# EAGLE design 4x4 Keypad with ATMega32 (EAGLE 9.6.0)
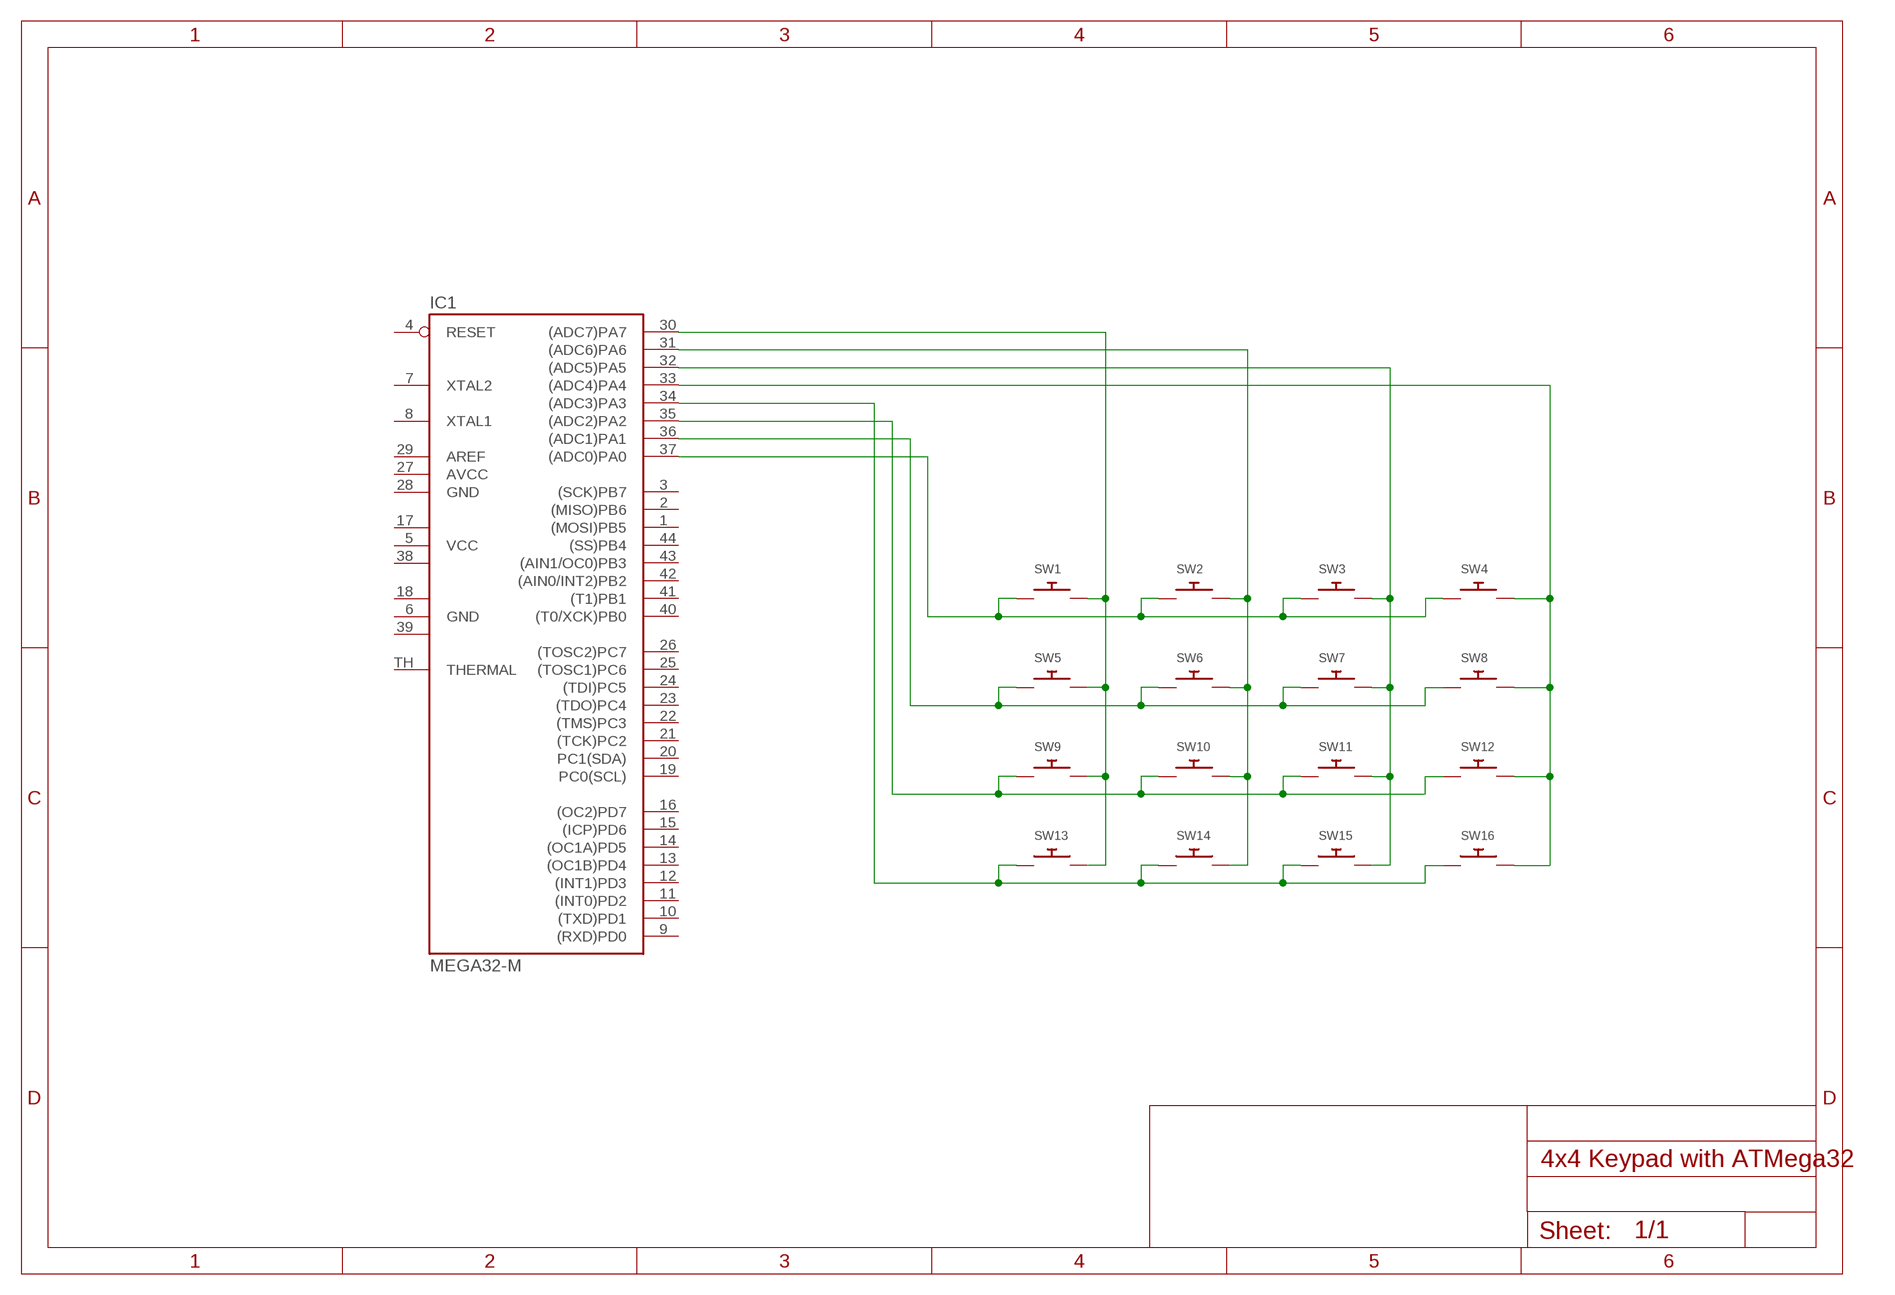
[diagram p0: schematic, sheet 1]

## Parts
IC1  MEGA32-M  [MLF44-TH]
SW1  SWITCH_PUSHBUTTONC&K_KSS  [BTN_CK_KSS]
SW2  SWITCH_PUSHBUTTONC&K_KSS  [BTN_CK_KSS]
SW3  SWITCH_PUSHBUTTONC&K_KSS  [BTN_CK_KSS]
SW4  SWITCH_PUSHBUTTONC&K_KSS  [BTN_CK_KSS]
SW5  SWITCH_PUSHBUTTONC&K_KSS  [BTN_CK_KSS]
SW6  SWITCH_PUSHBUTTONC&K_KSS  [BTN_CK_KSS]
SW7  SWITCH_PUSHBUTTONC&K_KSS  [BTN_CK_KSS]
SW8  SWITCH_PUSHBUTTONC&K_KSS  [BTN_CK_KSS]
SW9  SWITCH_PUSHBUTTONC&K_KSS  [BTN_CK_KSS]
SW10  SWITCH_PUSHBUTTONC&K_KSS  [BTN_CK_KSS]
SW11  SWITCH_PUSHBUTTONC&K_KSS  [BTN_CK_KSS]
SW12  SWITCH_PUSHBUTTONC&K_KSS  [BTN_CK_KSS]
SW13  SWITCH_PUSHBUTTONC&K_KSS  [BTN_CK_KSS]
SW14  SWITCH_PUSHBUTTONC&K_KSS  [BTN_CK_KSS]
SW15  SWITCH_PUSHBUTTONC&K_KSS  [BTN_CK_KSS]
SW16  SWITCH_PUSHBUTTONC&K_KSS  [BTN_CK_KSS]

## Nets
N$1: IC1.37((ADC0)PA0) SW1.P$1 SW2.P$1 SW3.P$1 SW4.P$1
N$2: IC1.33((ADC4)PA4) SW4.P$2 SW8.P$2 SW12.P$2 SW16.P$2
N$4: IC1.32((ADC5)PA5) SW3.P$2 SW7.P$2 SW11.P$2 SW15.P$2
N$5: IC1.35((ADC2)PA2) SW9.P$1 SW10.P$1 SW11.P$1 SW12.P$1
N$6: IC1.34((ADC3)PA3) SW13.P$1 SW14.P$1 SW15.P$1 SW16.P$1
N$7: IC1.31((ADC6)PA6) SW2.P$2 SW6.P$2 SW10.P$2 SW14.P$2
N$8: IC1.30((ADC7)PA7) SW1.P$2 SW5.P$2 SW9.P$2 SW13.P$2
N$9: IC1.36((ADC1)PA1) SW5.P$1 SW6.P$1 SW7.P$1 SW8.P$1
Unconnected: IC1.1((MOSI)PB5) IC1.2((MISO)PB6) IC1.3((SCK)PB7) IC1.4(RESET) IC1.7(XTAL2) IC1.8(XTAL1) IC1.9((RXD)PD0) IC1.10((TXD)PD1) IC1.11((INT0)PD2) IC1.12((INT1)PD3) IC1.13((OC1B)PD4) IC1.14((OC1A)PD5) IC1.15((ICP)PD6) IC1.16((OC2)PD7) IC1.19(PC0(SCL)) IC1.20(PC1(SDA)) IC1.21((TCK)PC2) IC1.22((TMS)PC3) IC1.23((TDO)PC4) IC1.24((TDI)PC5) IC1.25((TOSC1)PC6) IC1.26((TOSC2)PC7) IC1.29(AREF) IC1.40((T0/XCK)PB0) IC1.41((T1)PB1) IC1.42((AIN0/INT2)PB2) IC1.43((AIN1/OC0)PB3) IC1.44((SS)PB4) IC1.TH(THERMAL)

## Power pins joined to a net without a drawn wire
AVCC: IC1.27(AVCC)
GND: IC1.6(GND) IC1.28(GND)
GND1: IC1.18(GND1)
GND2: IC1.39(GND2)
VCC: IC1.5(VCC)
VCC1: IC1.17(VCC1)
VCC2: IC1.38(VCC2)

## Library data of the parts
IC1 = atmel:MEGA32-M: MICROCONTROLLER 32 Kbytes FLASH 2 Kbytes SRAM 1 Kbytes EEPROM USART 8-channel 10 bit ADC Source: www.atmel.com .. doc2503.pdf; MPN: ATMEGA32-16MU; OC_FARNELL: 1455108; OC_NEWARK: 58M3733
SW1-SW16 = adafruit:SWITCH_PUSHBUTTON: Buttons SOFTTOUCHSMD_SJ - Soft touch temporary push button (Super Junk Akihabara) Compatible with SKPMANE010 [Mouser: 688-SKPMAN] C&K_KSS = Digikey: KSS221GLFS

## Board
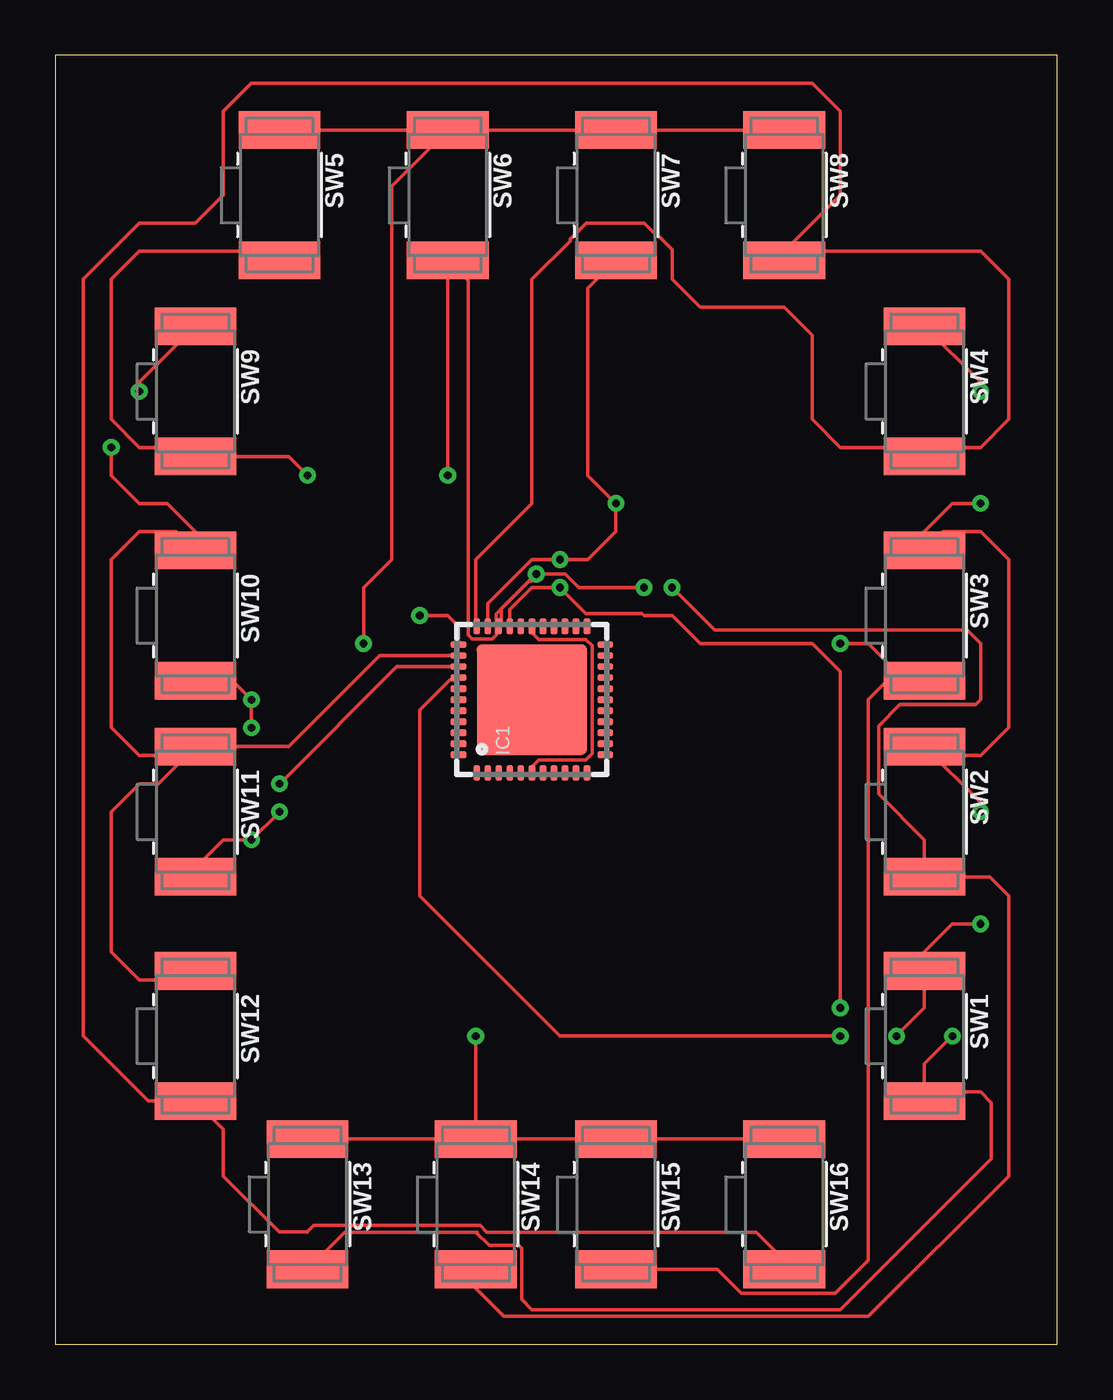
[diagram p1: board, top side]
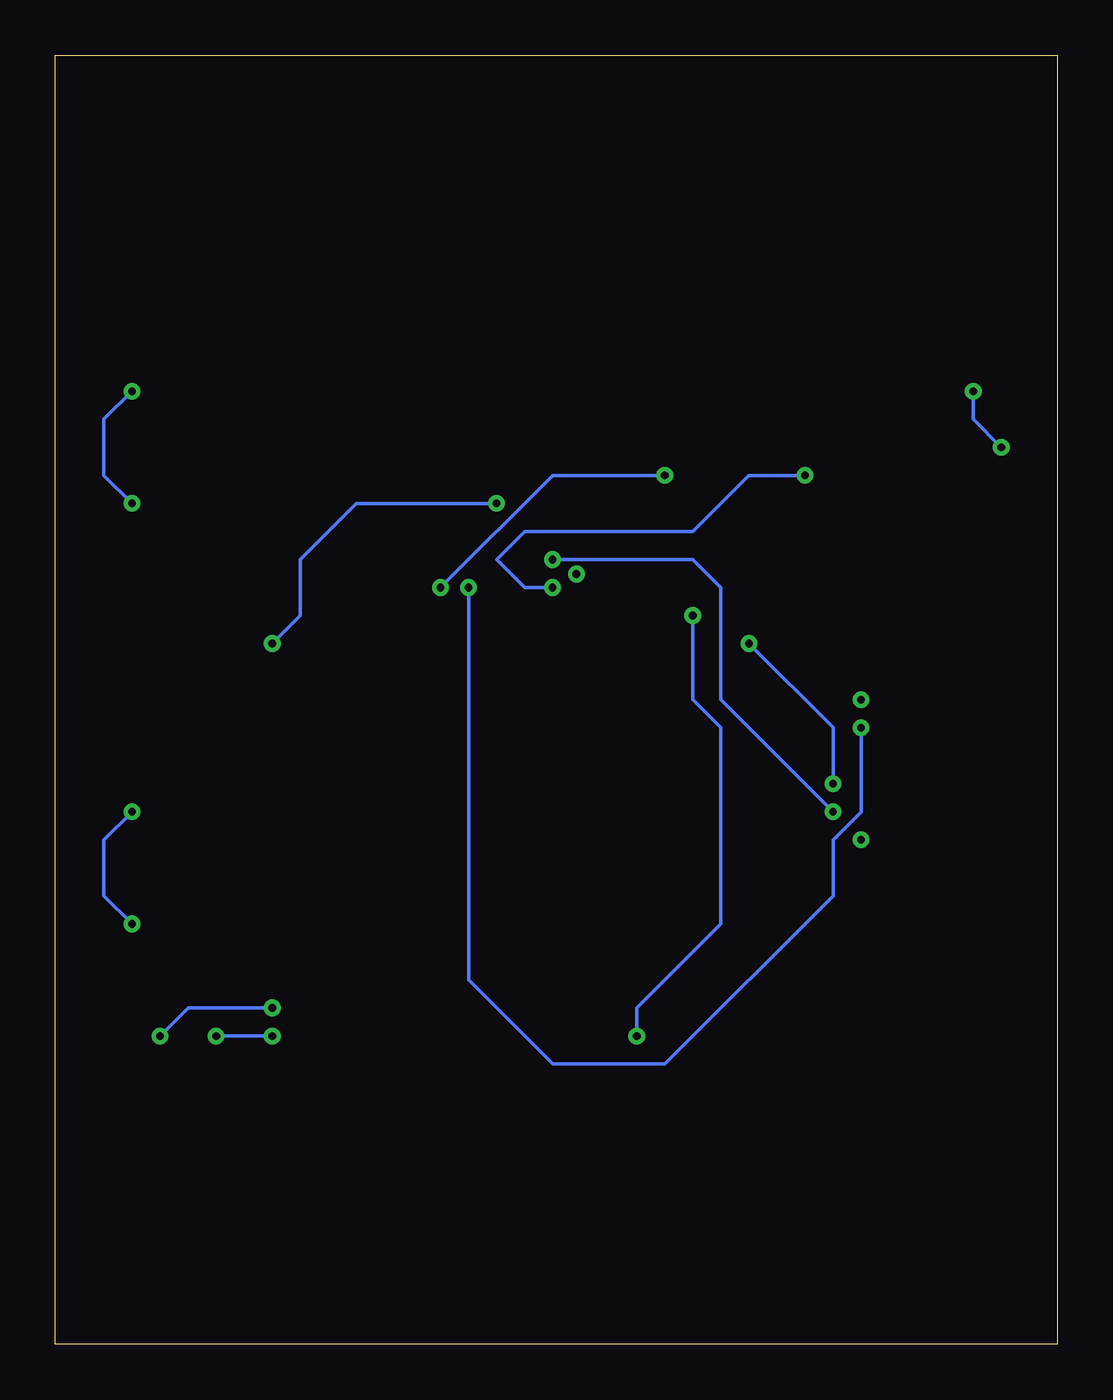
[diagram p2: board, bottom side, seen from below]

Size 45.39 x 58.41 mm. Coordinates in mm from the lower left corner, seen from the top.
Outline: 0,0 45.39,0 45.39,58.41 0,58.41 0,0
Copper layers (1*16): Top 0.035mm / dielectric 1.5mm / Bottom 0.035mm
Design rules "default": minimum track width 6mil, minimum drill 0.35mm, track to track 6mil, track to pad 6mil, pad to pad 6mil, via to via 6mil, smd to smd 6mil, copper to edge 40mil, drill to drill 6mil, minimum pad ring 10mil, minimum via ring 8mil, stop-mask expansion 4mil, vias tented up to drill 0mil, thermal gap 10mil

### Footprints (pad centres in the part's own frame; a part is rotated, then mirrored left to right if it is on the bottom)
MLF44-TH = smd 0.7 x 0.3: 1 -3.325,2.5; 2 -3.325,2; 3 -3.325,1.5; 4 -3.325,1; 5 -3.325,0.5; 6 -3.325,0; 7 -3.325,-0.5; 8 -3.325,-1; 9 -3.325,-1.5; 10 -3.325,-2; 11 -3.325,-2.5; 23 3.325,-2.5; 24 3.325,-2; 25 3.325,-1.5; 26 3.325,-1; 27 3.325,-0.5; 28 3.325,0; 29 3.325,0.5; 30 3.325,1; 31 3.325,1.5; 32 3.325,2; 33 3.325,2.5 | smd 0.3 x 0.7: 12 -2.5,-3.325; 13 -2,-3.325; 14 -1.5,-3.325; 15 -1,-3.325; 16 -0.5,-3.325; 17 0,-3.325; 18 0.5,-3.325; 19 1,-3.325; 20 1.5,-3.325; 21 2,-3.325; 22 2.5,-3.325; 34 2.5,3.325; 35 2,3.325; 36 1.5,3.325; 37 1,3.325; 38 0.5,3.325; 39 0,3.325; 40 -0.5,3.325; 41 -1,3.325; 42 -1.5,3.325; 43 -2,3.325; 44 -2.5,3.325 | smd 5 x 5: TH 0,0
BTN_CK_KSS = smd 1.7 x 3.7: P$1 -2.95,0; P$2 2.95,0

### Placement (x,y rotation side)
IC1  21.59,29.21 90 top
SW1  39.37,13.97 270 top
SW2  39.37,24.13 270 top
SW3  39.37,33.02 270 top
SW4  39.37,43.18 270 top
SW5  10.16,52.07 270 top
SW6  17.78,52.07 270 top
SW7  25.4,52.07 270 top
SW8  33.02,52.07 270 top
SW9  6.35,43.18 270 top
SW10  6.35,33.02 270 top
SW11  6.35,24.13 270 top
SW12  6.35,13.97 270 top
SW13  11.43,6.35 270 top
SW14  19.05,6.35 270 top
SW15  25.4,6.35 270 top
SW16  33.02,6.35 270 top

### Tracks (layer width: path | path; a pad name or v marks a point on that pad's centre or on a via)
GND
  Top 0.152: IC1.28 21.59,32.26 21.91,31.94 24.04,31.94 24.32,31.66 24.32,26.76 24.04,26.48 21.91,26.48 21.59,26.16 IC1.6
N$1  (via drill 0.35)
  Top 0.152: SW4.P$1 41.91,43.59 v41.91,43.18 | v41.91,24.13 41.91,24.54 SW2.P$1 39.78,26.67 41.91,26.67 43.18,27.94 43.18,35.56 41.91,36.83 40.23,36.83 SW3.P$1 39.37,36.83 40.64,38.1 v41.91,38.1 | v41.91,19.05 40.64,19.05 39.37,17.78 SW1.P$1 39.37,15.24 v38.1,13.97 | IC1.37 18.14,30.09 17.86,30.09 16.51,28.73 16.51,20.32 22.86,13.97 v35.56,13.97
  Bottom 0.152: v41.91,24.13 43.18,22.86 43.18,20.32 v41.91,19.05 | v41.91,43.18 43.18,41.91 43.18,39.37 v41.91,38.1 | v35.56,13.97 v38.1,13.97
N$2
  Top 0.152: SW8.P$2 33.23,49.33 | 33.23,49.33 33.43,49.53 41.91,49.53 43.18,48.26 43.18,41.91 41.91,40.64 39.37,40.64 SW4.P$2 38.96,40.64 35.56,40.64 34.29,41.91 34.29,45.72 33.02,46.99 29.21,46.99 27.94,48.26 27.94,49.6 27.34,50.2 27.27,50.2 26.67,50.8 24.06,50.8 23.32,50.06 23.32,49.99 21.59,48.26 21.59,38.1 19.05,35.56 19.05,32.58 IC1.33 | 11.41,5.08 11.42,5.09 | 11.42,5.09 11.71,5.38 19.25,5.38 19.55,5.08 31.75,5.08 33.02,3.81 SW16.P$2 | 33.23,49.33 33.23,49.73 35.56,52.07 35.56,55.88 34.29,57.15 8.89,57.15 7.62,55.88 7.62,52.07 6.35,50.8 3.81,50.8 1.27,48.26 1.27,13.97 4.22,11.02 SW12.P$2 7.62,9.75 7.62,7.62 10.15,5.09 11.42,5.09
N$4  (via drill 0.35)
  Top 0.152: SW15.P$2 30,3.4 31.07,2.32 35.34,2.32 36.83,3.81 36.83,29.21 37.69,30.07 SW3.P$2 38.51,30.07 36.83,31.75 v35.56,31.75 | SW11.P$2 6.55,21.39 | 6.55,21.39 6.76,21.59 | IC1.32 19.59,33.56 21.59,35.56 v22.86,35.56 24.13,35.56 25.4,36.83 v25.4,38.1 24.13,39.37 24.13,47.85 SW7.P$2 | 6.55,21.39 6.55,21.8 7.62,22.86 v8.89,22.86 v10.16,24.13
  Bottom 0.152: v22.86,35.56 16.51,35.56 15.24,34.29 15.24,29.21 v10.16,24.13 | v35.56,31.75 34.29,33.02 34.29,35.56 31.75,38.1 v25.4,38.1
N$5  (via drill 0.35)
  Top 0.152: SW11.P$1 5.94,26.67 3.81,26.67 2.54,27.94 2.54,35.56 3.81,36.83 5.49,36.83 SW10.P$1 6.35,36.83 5.08,38.1 3.81,38.1 2.54,39.37 v2.54,40.64 | SW11.P$1 4.67,25.4 3.81,25.4 2.54,24.13 2.54,17.78 3.81,16.51 5.94,16.51 SW12.P$1 | SW9.P$1 3.81,43.59 v3.81,43.18 | SW11.P$1 10.57,27.08 14.7,31.21 IC1.35
  Bottom 0.152: v3.81,43.18 3.81,41.91 v2.54,40.64
N$6  (via drill 0.35)
  Top 0.152: SW13.P$1 SW14.P$1 | SW14.P$1 SW15.P$1 SW16.P$1 | SW14.P$1 v19.05,13.97 | v16.51,33.02 17.78,33.02 18.27,32.53 IC1.34
  Bottom 0.152: v16.51,33.02 16.51,29.21 15.24,27.94 15.24,19.05 19.05,15.24 v19.05,13.97
N$7  (via drill 0.35)
  Top 0.152: IC1.31 20.21,32.66 20.21,33.34 21.46,34.59 21.59,34.59 21.79,34.79 v21.79,34.9 | SW10.P$2 8.03,30.07 v8.89,29.21 v8.89,27.94 | v26.67,34.29 23.72,34.29 23.11,34.9 v21.79,34.9 | v21.79,34.9 21.77,34.9 19.97,33.1 19.97,32.13 19.79,31.96 18.89,31.96 18.71,32.13 18.71,48.19 SW6.P$2 v17.78,39.37 | v27.94,34.29 29.87,32.36 41.3,32.36 41.91,31.75 41.91,29.21 41.69,28.99 38.26,28.99 37.29,28.02 37.29,24.94 39.37,22.86 SW2.P$2 42.32,21.18 43.18,20.32 43.18,7.62 36.83,1.27 20.32,1.27 19.05,2.54 SW14.P$2
  Bottom 0.152: v26.67,34.29 26.67,16.51 22.86,12.7 17.78,12.7 10.16,20.32 10.16,22.86 8.89,24.13 v8.89,27.94 | v17.78,39.37 22.86,39.37 v27.94,34.29
N$8  (via drill 0.35)
  Top 0.152: SW5.P$2 9.75,49.53 3.81,49.53 2.54,48.26 2.54,41.91 3.81,40.64 6.35,40.64 SW9.P$2 10.57,40.23 v11.43,39.37 | SW13.P$2 13.11,5.08 19.05,5.08 | 39.58,11.22 39.78,11.43 41.91,11.43 42.39,10.95 42.39,8.41 35.56,1.57 21.59,1.57 21.13,2.04 21.13,4.34 21,4.48 19.65,4.48 19.05,5.08 | 39.58,11.22 SW1.P$2 | 19.05,5.08 19.12,5.08 | IC1.30 20.59,33.29 21.59,34.29 v22.86,34.29 24.04,33.11 26.58,33.11 26.67,33.02 27.94,33.02 29.21,31.75 34.29,31.75 35.56,30.48 v35.56,15.24 | v40.64,13.97 39.37,12.7 39.37,11.43 39.58,11.22
  Bottom 0.152: v11.43,39.37 13.97,39.37 16.51,36.83 24.13,36.83 25.4,35.56 24.13,34.29 v22.86,34.29 | v35.56,15.24 39.37,15.24 v40.64,13.97
N$9  (via drill 0.35)
  Top 0.152: SW6.P$1 23.72,55.02 24.13,54.61 25.4,54.61 SW7.P$1 SW8.P$1 | SW5.P$1 SW6.P$1 | SW6.P$1 17.78,54.61 | SW6.P$1 15.24,52.48 15.24,35.56 13.97,34.29 v13.97,31.75 | IC1.36 15.47,30.71 v10.16,25.4
  Bottom 0.152: v10.16,25.4 10.16,27.94 v13.97,31.75